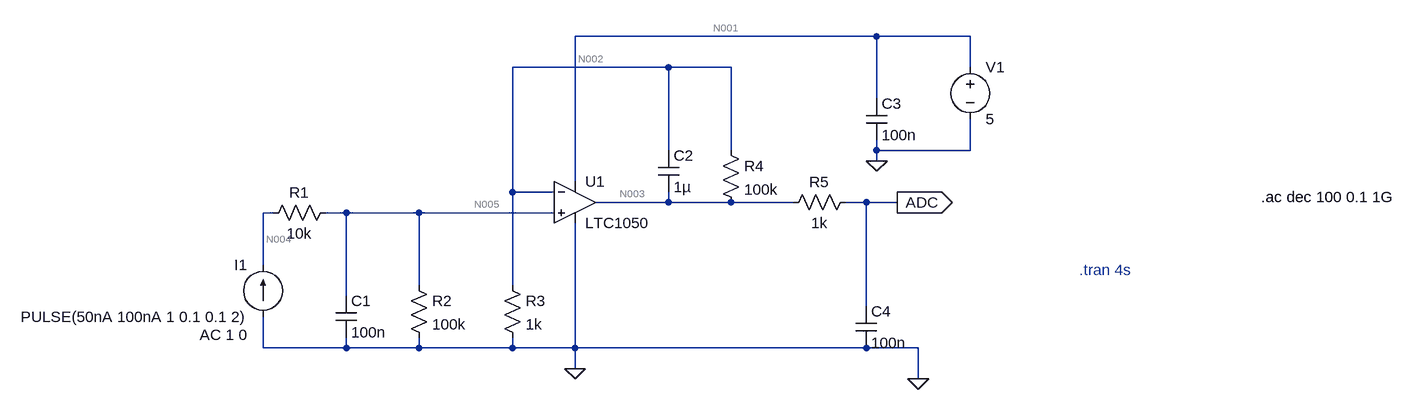
[diagram p0: schematic Schematique_ampli.asc]
Schematique_ampli.asc, the LTspice schematic file:
Version 4
SHEET 1 1720 680
WIRE 912 -160 448 -160
WIRE 1056 -160 912 -160
WIRE 592 -112 352 -112
WIRE 688 -112 592 -112
WIRE 1056 -112 1056 -160
WIRE 912 -64 912 -160
WIRE 592 16 592 -112
WIRE 688 16 688 -112
WIRE 912 16 912 0
WIRE 1056 16 1056 -32
WIRE 1056 16 912 16
WIRE 912 32 912 16
WIRE 448 64 448 -160
WIRE 352 80 352 -112
WIRE 416 80 352 80
WIRE 592 96 592 80
WIRE 592 96 480 96
WIRE 688 96 592 96
WIRE 784 96 688 96
WIRE 896 96 864 96
WIRE 944 96 896 96
WIRE -16 112 -32 112
WIRE 96 112 64 112
WIRE 208 112 96 112
WIRE 416 112 208 112
WIRE -32 192 -32 112
WIRE 208 224 208 112
WIRE 352 224 352 80
WIRE 96 240 96 112
WIRE 896 256 896 96
WIRE -32 320 -32 272
WIRE 96 320 96 304
WIRE 96 320 -32 320
WIRE 208 320 208 304
WIRE 208 320 96 320
WIRE 352 320 352 304
WIRE 352 320 208 320
WIRE 448 320 448 128
WIRE 448 320 352 320
WIRE 896 320 448 320
WIRE 976 320 896 320
WIRE 448 352 448 320
WIRE 976 368 976 320
FLAG 448 352 0
FLAG 976 368 0
FLAG 912 32 0
FLAG 944 96 ADC
IOPIN 944 96 Out
SYMBOL res 80 96 R90
WINDOW 0 0 56 VBottom 2
WINDOW 3 32 56 VTop 2
SYMATTR InstName R1
SYMATTR Value 10k
SYMATTR SpiceLine tol=1 pwr=0.1
SYMBOL res 192 208 R0
SYMATTR InstName R2
SYMATTR Value 100k
SYMBOL res 336 208 R0
SYMATTR InstName R3
SYMATTR Value 1k
SYMBOL res 672 0 R0
SYMATTR InstName R4
SYMATTR Value 100k
SYMBOL res 880 80 R90
WINDOW 0 0 56 VBottom 2
WINDOW 3 32 56 VTop 2
SYMATTR InstName R5
SYMATTR Value 1k
SYMBOL cap 80 240 R0
SYMATTR InstName C1
SYMATTR Value 100n
SYMBOL cap 576 16 R0
SYMATTR InstName C2
SYMATTR Value 1µ
SYMBOL cap 896 -64 R0
SYMATTR InstName C3
SYMATTR Value 100n
SYMBOL cap 880 256 R0
SYMATTR InstName C4
SYMATTR Value 100n
SYMBOL OpAmps\\LTC1050 448 32 R0
SYMATTR InstName U1
SYMBOL voltage 1056 -128 R0
WINDOW 123 0 0 Left 0
WINDOW 39 0 0 Left 0
SYMATTR InstName V1
SYMATTR Value 5
SYMBOL current -32 272 R180
WINDOW 0 24 80 Left 2
WINDOW 3 24 0 Left 2
WINDOW 123 24 -28 Left 2
WINDOW 39 0 0 Left 0
SYMATTR InstName I1
SYMATTR Value PULSE(50nA 100nA 1 0.1 0.1 2)
SYMATTR Value2 AC 1 0
TEXT 1224 200 Left 2 ;.tran 4s
TEXT 1504 88 Left 2 !.ac dec 100 0.1 1G

The netlist it stands for:
* Schematique_ampli.asc
R1 N005 N004 10k tol=1 pwr=0.1
R2 N005 0 100k
R3 N002 0 1k
R4 N002 N003 100k
R5 ADC N003 1k
C1 N005 0 100n
C2 N002 N003 1µ
C3 N001 0 100n
C4 ADC 0 100n
XU1 N005 N002 N001 0 N003 LTC1050  ; pins In+ In- V+ V- OUT
V1 N001 0 5
I1 0 N004 PULSE(50nA 100nA 1 0.1 0.1 2) AC 1 0
* .tran 4s
.ac dec 100 0.1 1G
.lib LTC.lib
.backanno
.end

* Results of the author's LTspice run, read from the files saved beside the schematic
* Operating Point, zero values left out:
*   V(n005) = 5 mV
*   V(n004) = 5.5 mV
*   V(n002) = 5 mV
*   V(n003) = 505 mV
*   V(adc) = 505 mV
*   V(n001) = 5 V
*   I(I1) = 50 nA
*   I(R1) = -50 nA
*   I(R2) = 50 nA
*   I(R3) = 5 µA
*   I(R4) = -5 µA
*   I(V1) = -754.1 µA
*   Ix(u1:3) = 754.1 µA
*   Ix(u1:4) = -749.1 µA
*   Ix(u1:5) = -5 µA
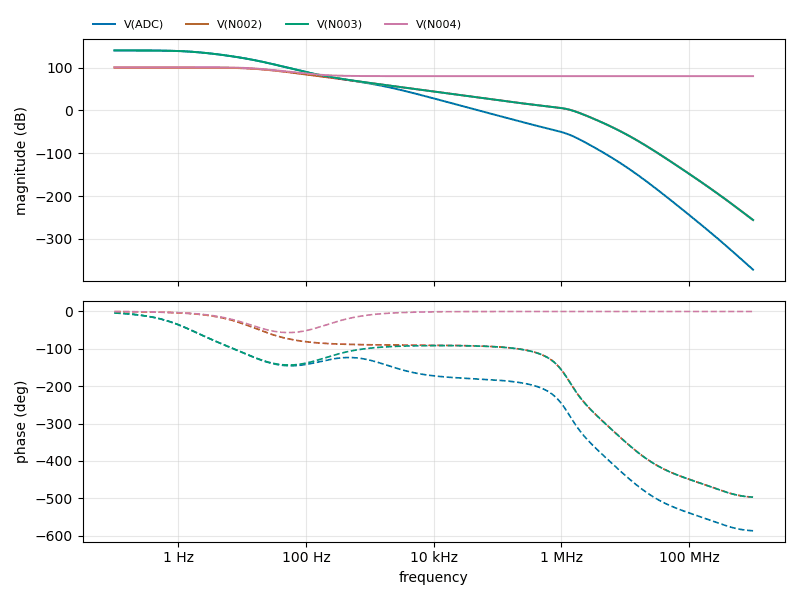
[diagram p1: AC Analysis of Schematique_ampli.asc, plotted from the saved traces]
* AC Analysis, 1 run:
*   V(ADC): 140.07 dB at 100 mHz, -371.90 dB at 1 GHz, peak 140.07 dB at 100 mHz, 3 dB below the peak at 1.582 Hz
*   V(N002): 100.00 dB at 100 mHz, -255.94 dB at 1 GHz, peak 100.00 dB at 100 mHz, 3 dB below the peak at 15.91 Hz
*   V(N003): 140.07 dB at 100 mHz, -255.94 dB at 1 GHz, peak 140.07 dB at 100 mHz, 3 dB below the peak at 1.582 Hz
*   V(N004): 100.83 dB at 100 mHz, 80.00 dB at 1 GHz, peak 100.83 dB at 100 mHz, 3 dB below the peak at 16.05 Hz